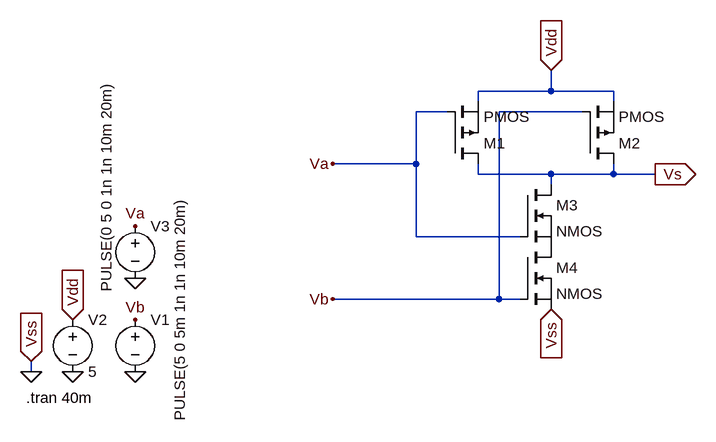
[diagram p0: schematic NET.asc]
NET.asc, the LTspice schematic file:
Version 4
SHEET 1 880 680
WIRE -160 -608 -160 -640
WIRE -160 -608 -272 -608
WIRE -64 -608 -160 -608
WIRE -272 -592 -272 -608
WIRE -64 -592 -64 -608
WIRE -320 -576 -368 -576
WIRE -112 -576 -240 -576
WIRE -368 -496 -368 -576
WIRE -368 -496 -496 -496
WIRE -272 -480 -272 -496
WIRE -160 -480 -272 -480
WIRE -64 -480 -64 -496
WIRE -64 -480 -160 -480
WIRE 0 -480 -64 -480
WIRE -160 -464 -160 -480
WIRE -368 -384 -368 -496
WIRE -208 -384 -368 -384
WIRE -240 -288 -240 -576
WIRE -240 -288 -496 -288
WIRE -208 -288 -240 -288
WIRE -960 -176 -960 -192
FLAG -800 -176 0
FLAG -800 -256 Vb
FLAG -960 -176 0
FLAG -960 -192 Vss
IOPIN -960 -192 In
FLAG -896 -176 0
FLAG -896 -256 Vdd
IOPIN -896 -256 In
FLAG -800 -320 0
FLAG -800 -400 Va
FLAG -496 -496 Va
FLAG -496 -288 Vb
FLAG -160 -640 Vdd
IOPIN -160 -640 In
FLAG -160 -272 Vss
IOPIN -160 -272 In
FLAG 0 -480 Vs
IOPIN 0 -480 Out
SYMBOL voltage -800 -272 R0
WINDOW 3 69 172 VLeft 2
WINDOW 123 0 0 Left 0
WINDOW 39 0 0 Left 0
SYMATTR InstName V1
SYMATTR Value PULSE(5 0 5m 1n 1n 10m 20m)
SYMBOL voltage -896 -272 R0
SYMATTR InstName V2
SYMATTR Value 5
SYMBOL voltage -800 -416 R0
WINDOW 3 -44 117 VLeft 2
WINDOW 123 0 0 Left 0
WINDOW 39 0 0 Left 0
SYMATTR InstName V3
SYMATTR Value PULSE(0 5 0 1n 1n 10m 20m)
SYMBOL pmos -320 -496 M180
SYMATTR InstName M1
SYMBOL pmos -112 -496 M180
SYMATTR InstName M2
SYMBOL nmos -208 -464 R0
SYMATTR InstName M3
SYMBOL nmos -208 -368 R0
SYMATTR InstName M4
TEXT -968 -136 Left 2 !.tran 40m

The netlist it stands for:
* NET.asc
V1 Vb 0 PULSE(5 0 5m 1n 1n 10m 20m)
V2 Vdd 0 5
V3 Va 0 PULSE(0 5 0 1n 1n 10m 20m)
M1 Vs Va Vdd Vdd PMOS
M2 Vs Vb Vdd Vdd PMOS
M3 Vs Va P001 P001 NMOS
M4 P001 Vb 0 0 NMOS
.model NMOS NMOS
.model PMOS PMOS
.lib standard.mos
.tran 40m
.backanno
.end